# EAGLE design Esquema (EAGLE 9.6.2)
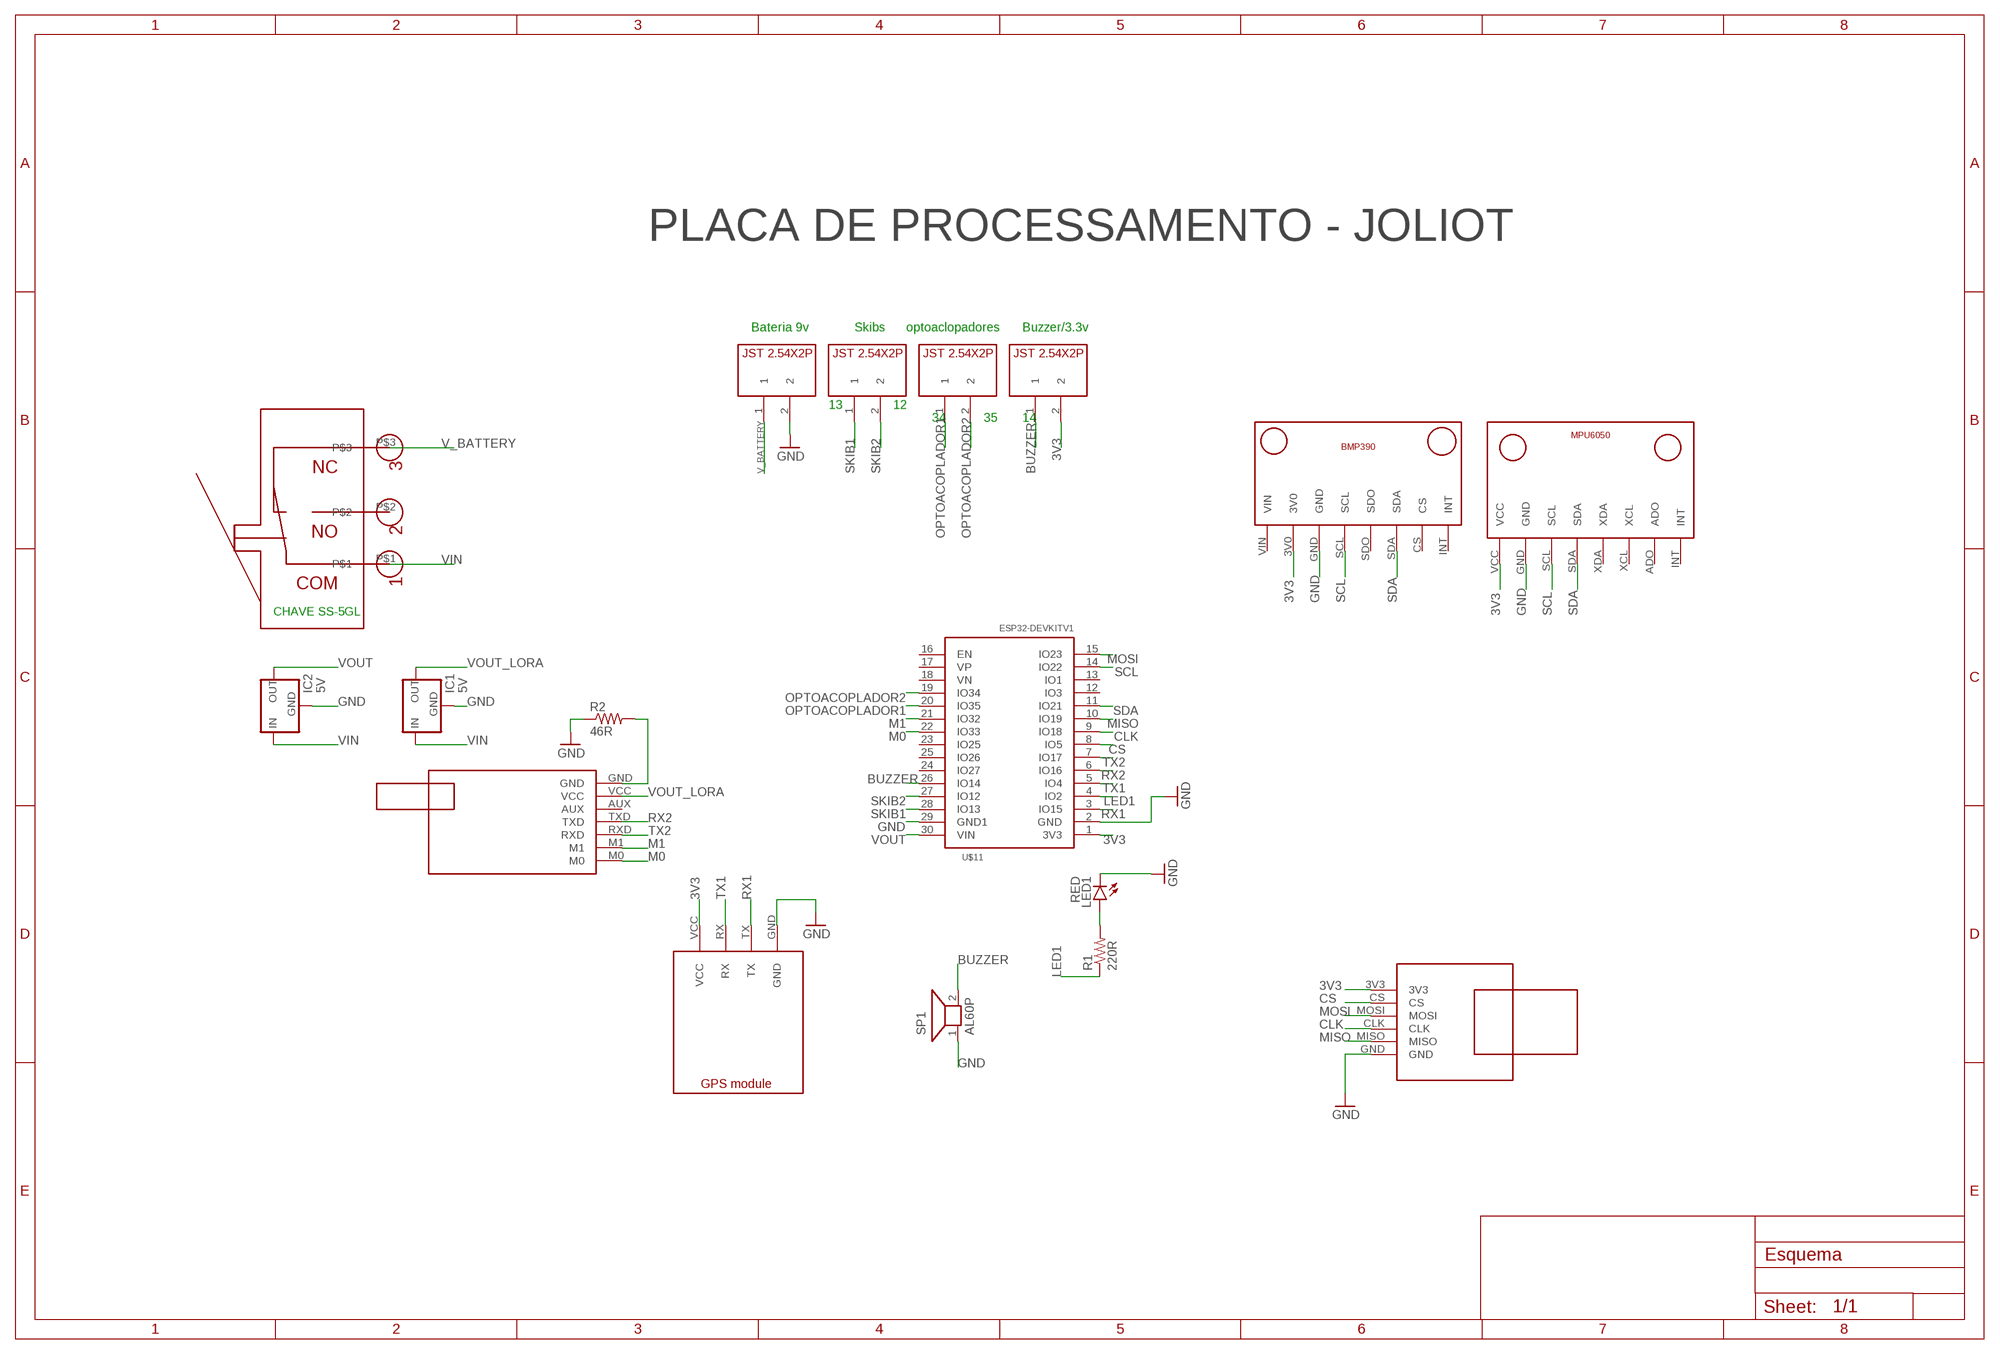
[diagram p0: schematic, sheet 1]

## Parts
IC1  5V  78XXL  [78XXL]
IC2  5V  78XXL  [78XXL]
LED1  RED  LED5MM  [LED5MM]
R1  220R  R-US_0309/12  [0309/12]
R2  46R  R-US_0309/12  [0309/12]
SP1  AL60P  [AL60P]
U$1  BMP390V1  [BMP390_FOOTPRINT]
U$2  E22-400T30D  [E22-400T30D_FOOTPRINT]
U$3  GPS_MODULE  [GPS_MODULE_FOOTPRINT]
U$4  JST2.54X2P  [JST2.54X2P_FOOTPRINT]
U$5  JST2.54X2P  [JST2.54X2P_FOOTPRINT]
U$6  JST2.54X2P  [JST2.54X2P_FOOTPRINT]
U$7  JST2.54X2P  [JST2.54X2P_FOOTPRINT]
U$8  MICROSD_SMALL_READER  [MICROSD_SMALL_READER_FOOTPRINT]
U$9  MPU6050V1  [MPU6050_FOOTPRINT]
U$11  ESP32DEVKITV1  [ESP32-DEVKITV1]
U$12  CHAVE_SS-5GL  [CHAVESS-5GL]

## Nets
3V3: U$1.3V0 U$3.VCC U$4.2 U$8.3V3 U$9.VCC U$11.1(3V3)
BUZZER: SP1.2 U$4.1 U$11.26(IO14)
CLK: U$8.CLK U$11.9(IO18)
CS: U$8.CS U$11.8(IO5)
GND: IC1.GND IC2.GND LED1.K(C) R2.1 SP1.1 U$1.GND U$3.GND U$7.2 U$8.GND U$9.GND U$11.2(GND) U$11.29(GND1)
LED1: R1.1 U$11.4(IO2)
M0: U$2.M0 U$11.22(IO33)
M1: U$2.M1 U$11.21(IO32)
MISO: U$8.MISO U$11.10(IO19)
MOSI: U$8.MOSI U$11.15(IO23)
N$4: LED1.A R1.2
N$7: R2.2 U$2.GND
OPTOACOPLADOR1: U$5.1 U$11.20(IO35)
OPTOACOPLADOR2: U$5.2 U$11.19(IO34)
RX1: U$3.TX U$11.3(IO15)
RX2: U$2.TXD U$11.6(IO16)
SCL: U$1.SCL U$9.SCL U$11.14(IO22)
SDA: U$1.SDA U$9.SDA U$11.11(IO21)
SKIB1: U$6.1 U$11.28(IO13)
SKIB2: U$6.2 U$11.27(IO12)
TX1: U$3.RX U$11.5(IO4)
TX2: U$2.RXD U$11.7(IO17)
V_BATTERY: U$7.1 U$12.P$3
VIN: IC1.IN IC2.IN U$12.P$1
VOUT: IC2.OUT U$11.30(VIN)
VOUT_LORA: IC1.OUT U$2.VCC
Unconnected: U$1.CS U$1.INT U$1.SDO U$1.VIN U$2.AUX U$9.ADO U$9.INT U$9.XCL U$9.XDA U$11.12(IO3) U$11.13(IO1) U$11.16(EN) U$11.17(VP) U$11.18(VN) U$11.23(IO25) U$11.24(IO27) U$11.25(IO26) U$12.P$2

## Notes on the sheet
- PLACA DE PROCESSAMENTO - JOLIOT
- Bateria 9v | Skibs | optoaclopadores | Buzzer/3.3v
- 13 | 12
- 34 | 35 | 14

## Library data of the parts
IC1 IC2 = v-reg:78XXL: VOLTAGE REGULATOR
LED1 = led:LED: LED OSRAM: - CHIPLED LG R971, LG N971, LY N971, LG Q971, LY Q971, LO R971, LY R971 LH N974, LH R974 LS Q976, LO Q976, LY Q976 LO Q996 - Hyper CHIPLED LW Q18S LB Q993, LB Q99A, LB R99A - SideLED LS A670, LO A670, LY A670, LG A670, LP A670 LB A673, LV A673, LT A673, LW A673 LH A674 LY A675 LS A676, LA A676, LO A676, LY A676, LW A676 LS A679, LY A679, LG A679 - Hyper Micro SIDELED® LS Y876, LA Y876, LO Y876, LY Y876 LT Y87S - SmartLED LW L88C, LW L88S LB L89C, LB L89S, LG L890 LS L89K, LO L89K, LY L89K LS L896, LA L896, LO L896, LY L896 - TOPLED LS T670, LO T670, LY T670, LG T670, LP T670 LSG T670, LSP T670, LSY T670, LOP T670, LYG T670 LG T671, LOG T671, LSG T671 LB T673, LV T673, LT T673, LW T673 LH T674 LS T676, LA T676, LO T676, LY T676, LB T676, LH T676, LSB T676, LW T676 LB T67C, LV T67C, LT T67C, LS T67K, LO T67K, LY T67K, LW E67C LS E67B, LA E67B, LO E67B, LY E67B, LB E67C, LV E67C, LT E67C LW T67C LS T679, LY T679, LG T679 LS T770, LO T770, LY T770, LG T770, LP T770 LB T773, LV T773, LT T773, LW T773 LH T774 LS E675, LA E675, LY E675, LS T675 LS T776, LA T776, LO T776, LY T776, LB T776 LHGB T686 LT T68C, LB T68C - Hyper Mini TOPLED® LB M676 - Mini TOPLED Santana® LG M470 LS M47K, LO M47K, LY M47K Source: http://www.osram.convergy.de LUXEON: - LUMILED® LXK2-PW12-R00, LXK2-PW12-S00, LXK2-PW14-U00, LXK2-PW14-V00 LXK2-PM12-R00, LXK2-PM12-S00, LXK2-PM14-U00 LXK2-PE12-Q00, LXK2-PE12-R00, LXK2-PE12-S00, LXK2-PE14-T00, LXK2-PE14-U00 LXK2-PB12-K00, LXK2-PB12-L00, LXK2-PB12-M00, LXK2-PB14-N00, LXK2-PB14-P00, LXK2-PB14-Q00 LXK2-PR12-L00, LXK2-PR12-M00, LXK2-PR14-Q00, LXK2-PR14-R00 LXK2-PD12-Q00, LXK2-PD12-R00, LXK2-PD12-S00 LXK2-PH12-R00, LXK2-PH12-S00 LXK2-PL12-P00, LXK2-PL12-Q00, LXK2-PL12-R00 Source: www.luxeon.com KINGBRIGHT: KA-3528ASYC Source: www.kingbright.com
R1 R2 = rcl:R-US_: RESISTOR, American symbol; SPICEPREFIX: R
SP1 = buzzer:AL60P: SPEAKER Source: Buerklin; OC_FARNELL: unknown; OC_NEWARK: unknown
U$1 = CRD:BMP390: Sensor barométrico
U$2 = CRD:E22-400T30D
U$3 = CRD:GPS_MODULE
U$4-U$7 = CRD:JST2.54X2P: Conector JST 2 pinos (2.54mm de distância entre pinos)
U$8 = CRD:MICROSD_SMALL_READER
U$9 = CRD:MPU6050: Acelerômetro e Giroscópio
U$11 = ESP32-DEVKITV1:ESP32DEVKITV1
U$12 = CRD:CHAVE_SS-5GL

## Board
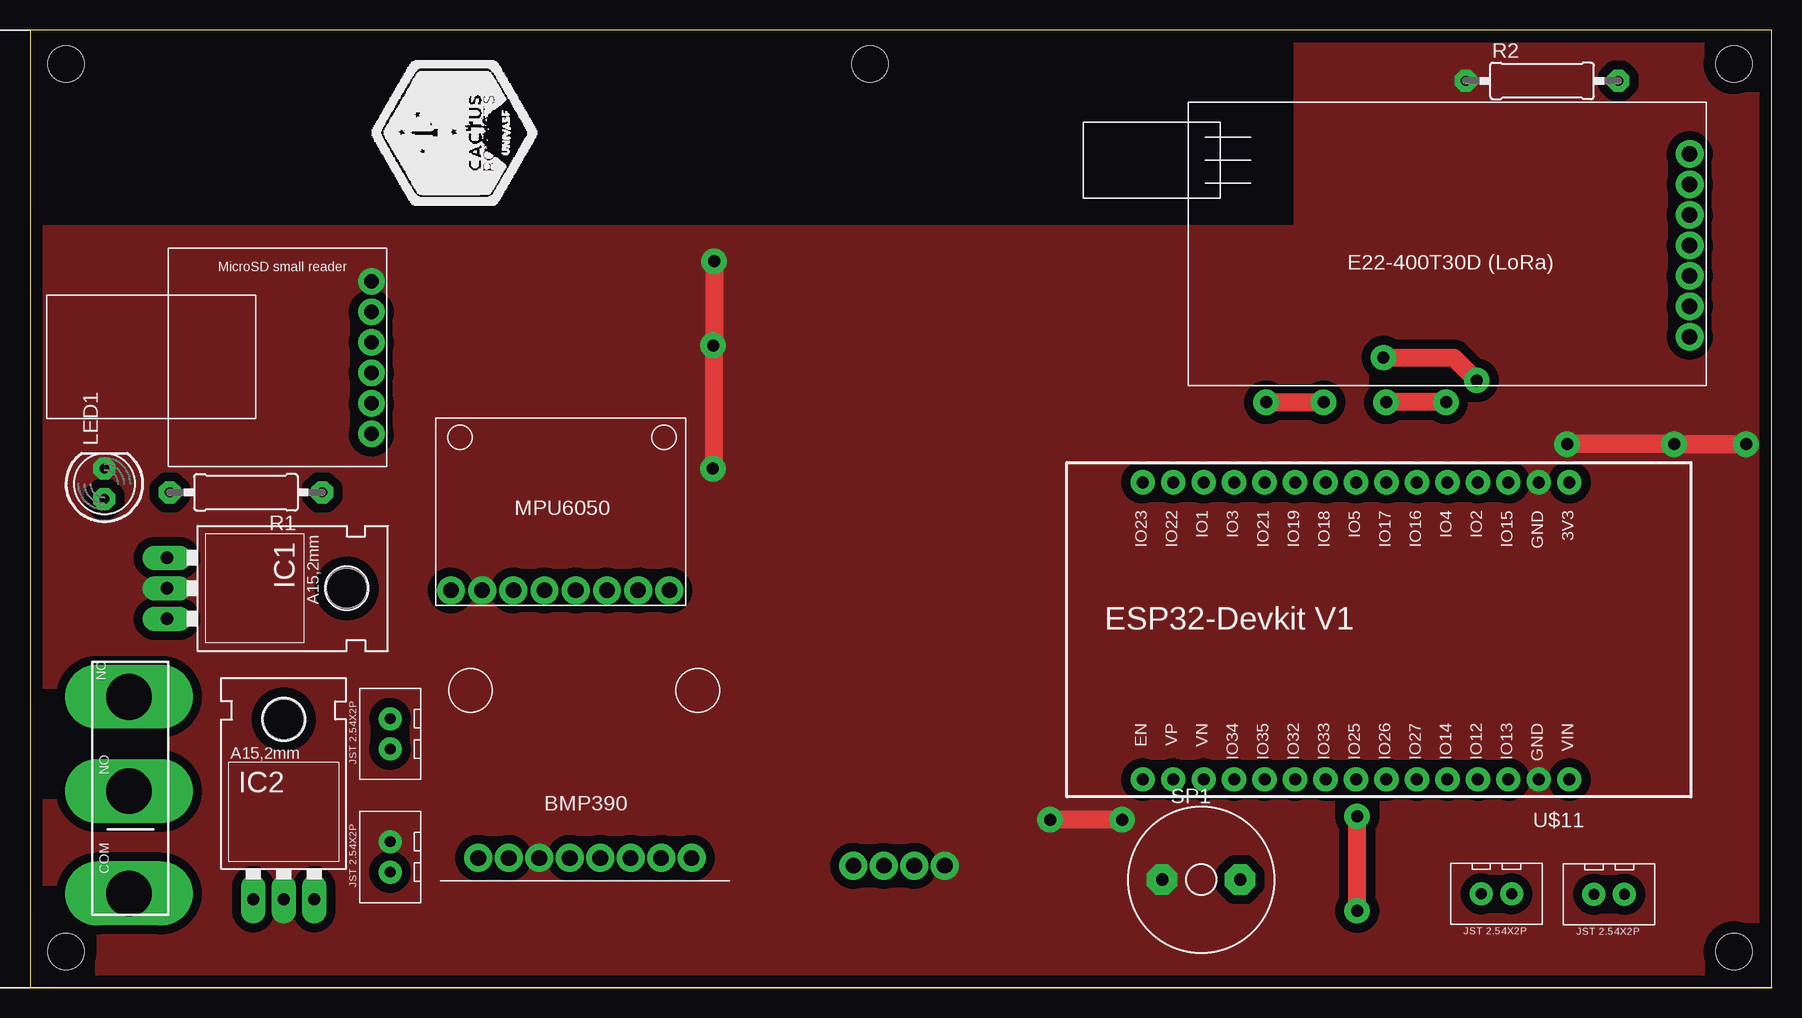
[diagram p1: board, top side]
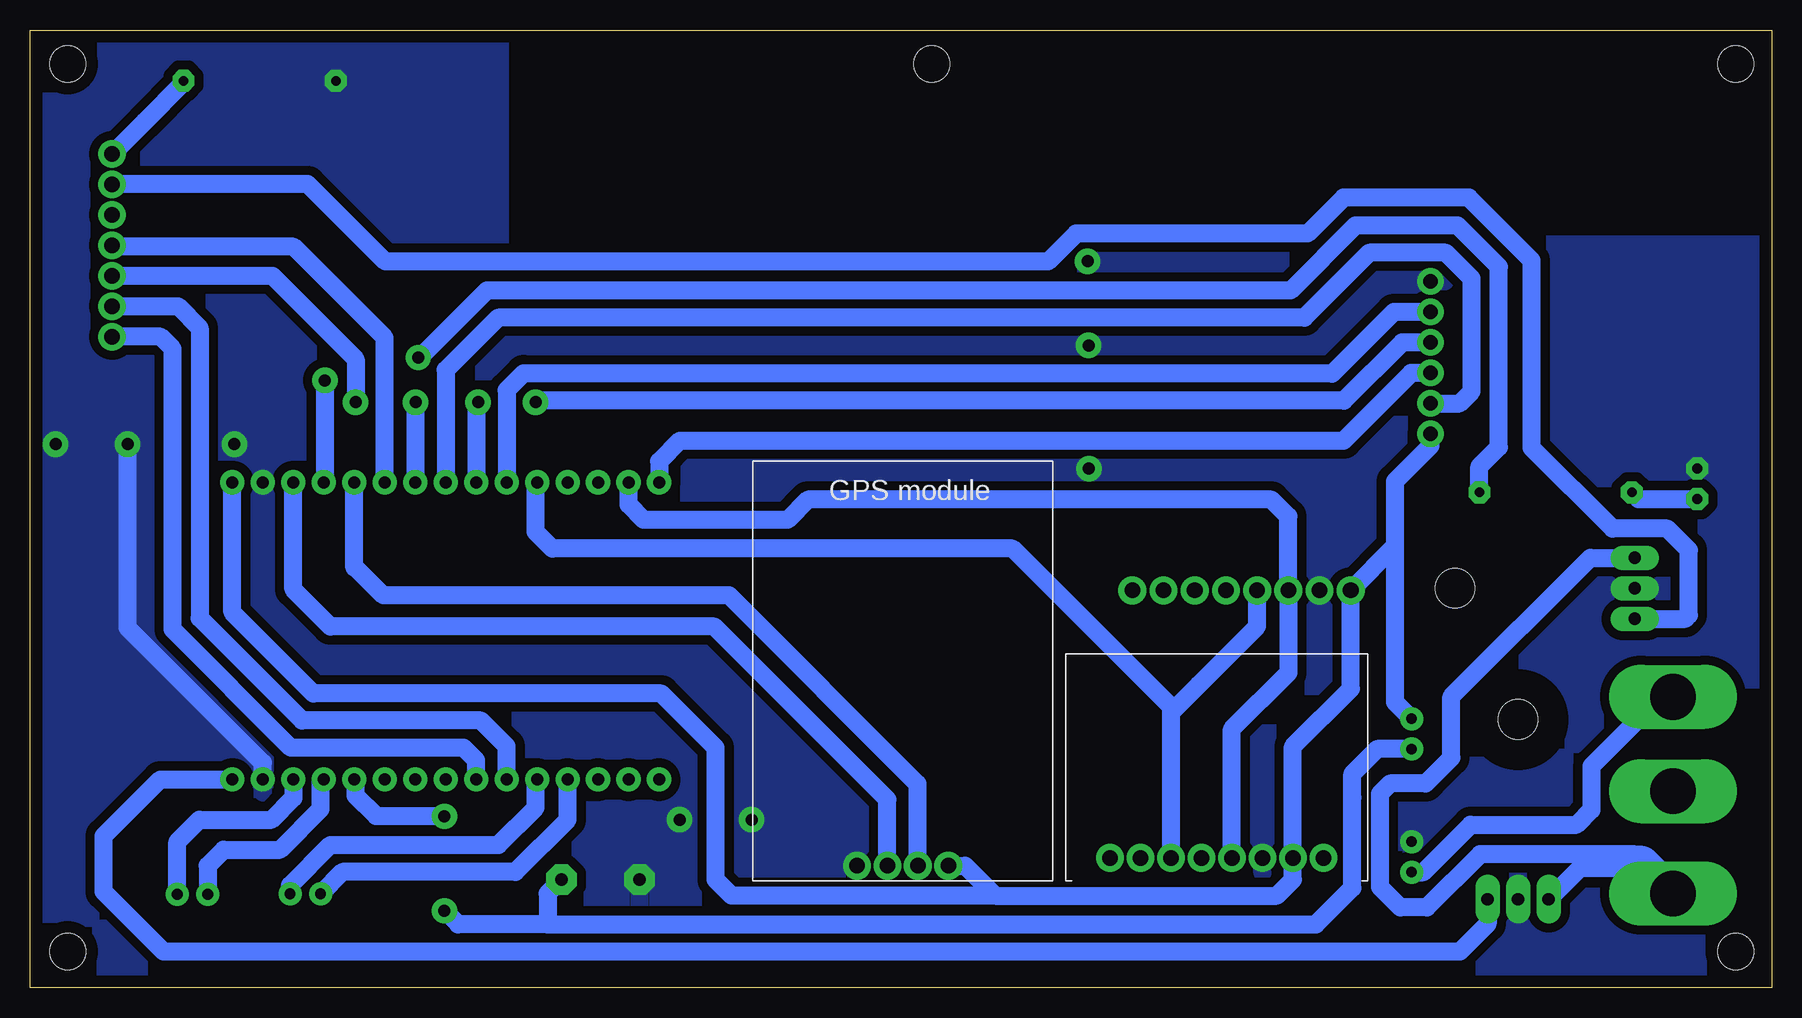
[diagram p2: board, bottom side, seen from below]

Size 145.14 x 79.84 mm. Coordinates in mm from the lower left corner, seen from the top.
Outline: 0,0 145.14,0 145.14,79.84 0,79.84 0,0
Copper layers (1*16): Top 0.035mm / dielectric 1.5mm / Bottom 0.035mm
Design rules "default *": minimum track width 1.5mm, minimum drill 1mm, track to track 30mil, track to pad 20mil, pad to pad 6mil, via to via 6mil, smd to smd 6mil, copper to edge 40mil, drill to drill 6mil, minimum pad ring 20mil, minimum via ring 22mil, stop-mask expansion 4mil, vias tented up to drill 0mil, thermal gap 0mil
Holes 3 mm at 142,77 142,3 3,3 3,77 70,77

### Footprints (pad centres in the part's own frame; a part is rotated, then mirrored left to right if it is on the bottom)
78XXL = drill 1.016 long: GND 0,-3.81; IN -2.54,-3.81; OUT 2.54,-3.81 | hole 3.302: 0,11.176
LED5MM = drill 0.813 octagon: A -1.27,0; K 1.27,0
0309/12 = drill 0.813 octagon: 1 -6.35,0; 2 6.35,0
AL60P = drill 1.016 pad 2.54 octagon: 1 -3.251,0; 2 3.251,0
BMP390_FOOTPRINT = drill 1.3: 3V0 -5.969,-8.382; CS 6.731,-8.382; GND -3.429,-8.382; INT 9.271,-8.382; SCL -0.889,-8.382; SDA 4.191,-8.382; SDO 1.651,-8.382; VIN -8.509,-8.382
E22-400T30D_FOOTPRINT = drill 1.3: AUX -16.383,-0.762; GND -16.383,-5.842; M0 -16.383,9.398; M1 -16.383,6.858; RXD -16.383,4.318; TXD -16.383,1.778; VCC -16.383,-3.302
GPS_MODULE_FOOTPRINT = drill 1.3: GND -4.01,-16.51; RX 1.07,-16.51; TX -1.47,-16.51; VCC 3.61,-16.51
JST2.54X2P_FOOTPRINT = drill 0.9: 1 -1.27,0; 2 1.27,0
MICROSD_SMALL_READER_FOOTPRINT = drill 1.2: 3V3 -7.239,6.35; CLK -7.239,-1.27; CS -7.239,3.81; GND -7.239,-6.35; MISO -7.239,-3.81; MOSI -7.239,1.27
MPU6050_FOOTPRINT = drill 1.3: ADO 6.686,-10.184; GND -6.314,-10.184; INT 9.286,-10.184; SCL -3.715,-10.184; SDA -1.115,-10.184; VCC -8.915,-10.184; XCL 4.085,-10.184; XDA 1.486,-10.184
ESP32-DEVKITV1 = drill 1 pad 1.93: 1 -22.87,-13.54; 2 -20.33,-13.54; 3 -17.79,-13.54; 4 -15.25,-13.54; 5 -12.71,-13.54; 6 -10.17,-13.54; 7 -7.63,-13.54; 8 -5.09,-13.54; 9 -2.55,-13.54; 10 -0.01,-13.54; 11 2.53,-13.54; 12 5.07,-13.54; 13 7.61,-13.54; 14 10.15,-13.54; 15 12.69,-13.54; 16 12.69,11.23; 17 10.15,11.23; 18 7.61,11.23; 19 5.07,11.23; 20 2.53,11.23; 21 -0.01,11.23; 22 -2.55,11.23; 23 -5.09,11.23; 24 -7.63,11.23; 25 -10.17,11.23; 26 -12.71,11.23; 27 -15.25,11.23; 28 -17.79,11.23; 29 -20.33,11.23; 30 -22.87,11.23
CHAVESS-5GL = drill 3.8 pad 3.048 long: P$1 -9.144,0.762; P$2 -0.635,0.762; P$3 7.239,0.762

### Placement (x,y rotation side)
IC1  15.22,33.3 270 top
IC2  21.14,11.18 0 top
LED1  6.2,42 90 top
R1  18,41.3 180 top
R2  126,75.6 0 top
SP1  97.6,9 0 top
U$1  45.87,19.19 0 top
U$2  121.92,63.66 180 top
U$3  72.22,26.67 0 bottom
U$4  30.01,21.15 90 top
U$5  122.2,7.82 180 top
U$6  131.6,7.78 180 top
U$7  30.01,10.9 90 top
U$8  21.21,52.52 180 top
U$9  43.99,43.31 0 top
U$11  105.41,28.59 180 top
U$12  9,17 90 top

### Tracks (layer width: path | path; a pad name or v marks a point on that pad's centre or on a via)
3V3
  Bottom 1.5: U$11.1 128.28,31.28 121.52,24.52 92.52,24.52 88,20 88,9 86.66,7.66 64.71,7.66 | 31.4,36.8 31.4,42.21 28.45,45.16 U$8.3V3 | 31.4,36.8 31.4,23.81 U$4.2 | U$3.VCC 67.21,10.16 64.71,7.66 | 64.71,7.66 41.24,7.66 39.9,9 U$1.3V0 39.9,20.1 35.08,24.92 U$9.VCC 31.4,36.8
BUZZER  (via drill 1)
  Top 1.5: v110.6,6.4 v110.6,14.28
  Bottom 1.5: U$11.26 118,17.24 118,16 116.3,14.3 110.62,14.3 v110.6,14.28 | v110.6,6.4 109.46,5.26 102,5.26 | SP1.2 102,7.85 102,5.26 | 102,5.26 37.98,5.26 34.94,8.3 34.94,15.82 34.94,17.83 33.92,18.84 32.89,19.88 U$4.1
CLK  (via drill 1)
  Top 1.5: v103,48.8 v107.8,48.8
  Bottom 1.5: v107.8,48.8 107.96,48.64 U$11.9 | U$8.CLK 30.8,53.79 35.66,48.93 102.87,48.93 v103,48.8
CS
  Bottom 1.5: U$11.8 110.5,51.5 106.14,55.86 38.95,55.86 33.54,61.27 27.15,61.27 25,59.11 25,49.71 26,48.71 U$8.CS
GND  (via drill 1)
  Top 1.5: v91,14 v85,14 | v56.9,43.27 56.98,43.34 56.98,53.44 56.92,53.49 v56.92,53.54 57,53.62 v57,60.55 | v128.1,45.3 v137,45.3 v143,45.3
  Bottom 1.5: U$11.29 125.74,18.74 137,30 v137,45.3
  pour Bottom: 1,1 146,1 146,79 106,79 106,62 1,62
  pour Top: 1,62.84 1,1 145,1 145,79 106,79 106,62.84
LED1  (via drill 1)
  Top 1.5: v112.79,52.52 118.66,52.52 v120.56,50.62
  Bottom 1.5: v112.79,52.52 112.67,52.52 107.08,58.12 40.09,58.12 34.69,63.53 26.18,63.53 22.74,60.09 22.74,45.06 24.35,43.45 R1.1 | v120.56,50.62 120.56,42.23 U$11.4
M0
  Bottom 1.5: U$11.22 107.96,18.96 109,20 123.4,20 133.26,29.86 133.26,53.26 134.26,54.26 U$2.M0
M1
  Bottom 1.5: U$11.21 105.42,20.12 107.56,22.26 122.46,22.26 131,30.8 131,55 132.8,56.8 U$2.M1
MISO
  Bottom 1.5: U$11.10 105.42,49.81 104.01,51.21 103.99,51.19 36.62,51.19 31.49,56.33 U$8.MISO
MOSI
  Bottom 1.5: U$11.15 92.72,43.88 90.99,45.61 35.68,45.61 30.04,51.25 U$8.MOSI
N$4
  Bottom 1.5: R1.2 11.08,40.73 LED1.A
N$7
  Bottom 1.5: U$2.GND 135.6,72.21 | 135.6,72.21 132.35,75.45 R2.2 | 135.6,72.21
OPTOACOPLADOR1
  Bottom 1.5: U$11.20 103,17.24 103,15 106.1,11.9 120.1,11.9 123.47,8.53 U$5.1
OPTOACOPLADOR2
  Bottom 1.5: U$11.19 100.34,14 104.7,9.64 119.11,9.64 U$5.2
RX1
  Bottom 1.5: U$3.TX 73.69,15.69 88.1,30.1 120.1,30.1 123.2,33.2 U$11.3
RX2
  Bottom 1.5: U$2.TXD 138.19,61.77 123.17,61.77 115.58,54.18 U$11.6
SCL
  Bottom 1.5: U$1.SCL 44.98,21.55 40.28,26.25 U$9.SCL 40.28,39.28 41.69,40.69 80.31,40.69 82,39 94,39 95.26,40.26 U$11.14
SDA
  Bottom 1.5: U$1.SDA 50.06,22.94 | U$9.SDA 42.88,30.12 47.75,25.25 50.06,22.94 | U$11.11 103,42.01 103,38 101.6,36.6 63.26,36.6 50.06,23.4 50.06,22.94
SKIB1
  Bottom 1.5: U$11.28 123.2,15.8 125,14 131.03,14 132.87,12.16 U$6.1
SKIB2
  Bottom 1.5: U$11.27 120.94,17.08 120.94,14.86 124.3,11.5 129,11.5 130.33,10.17 U$6.2
TX1
  Bottom 1.5: U$3.RX 71.19,10.2 71.19,17.01 86.89,32.7 115.7,32.7 118,35 118.12,35 U$11.5
TX2  (via drill 1)
  Top 1.5: v118,48.8 v113,48.8
  Bottom 1.5: U$2.RXD 124.94,59.34 118,52.4 v118,48.8 | v113,48.8 113.04,48.76 U$11.7
V_BATTERY
  Bottom 1.5: U$7.1 29.03,9.63 25.08,13.58 16.25,13.58 15.03,14.81 15.03,18.45 9.24,24.24
  Bottom 3.7: U$12.P$3 9.24,24.24 | U$12.P$3
VIN
  Bottom 1.5: IC2.IN 15.96,10 11,10 | U$12.P$1 11.5,11.11 24.3,11.11 28.73,6.68 30.95,6.68 32.65,8.39 32.65,16.15 31.79,17.02 28.84,17.02 28.6,17.25 26.68,19.17 26.68,24.27 15.12,35.84 IC1.IN
  Bottom 3.7: U$12.P$1 8.86,7.86 11,10
VOUT
  Bottom 1.5: U$11.30 134.28,17.36 139,12.64 139,8 134,3 25.98,3 23.68,5.3 IC2.OUT
VOUT_LORA
  Bottom 1.5: U$2.VCC 138.27,67 122,67 115.53,60.53 60.3,60.53 57.96,62.87 38.67,62.87 35.68,65.87 25.24,65.87 20,60.63 20,45 13.26,38.26 8.69,38.26 6.9,36.47 6.9,31.06 7.2,30.76 IC1.OUT